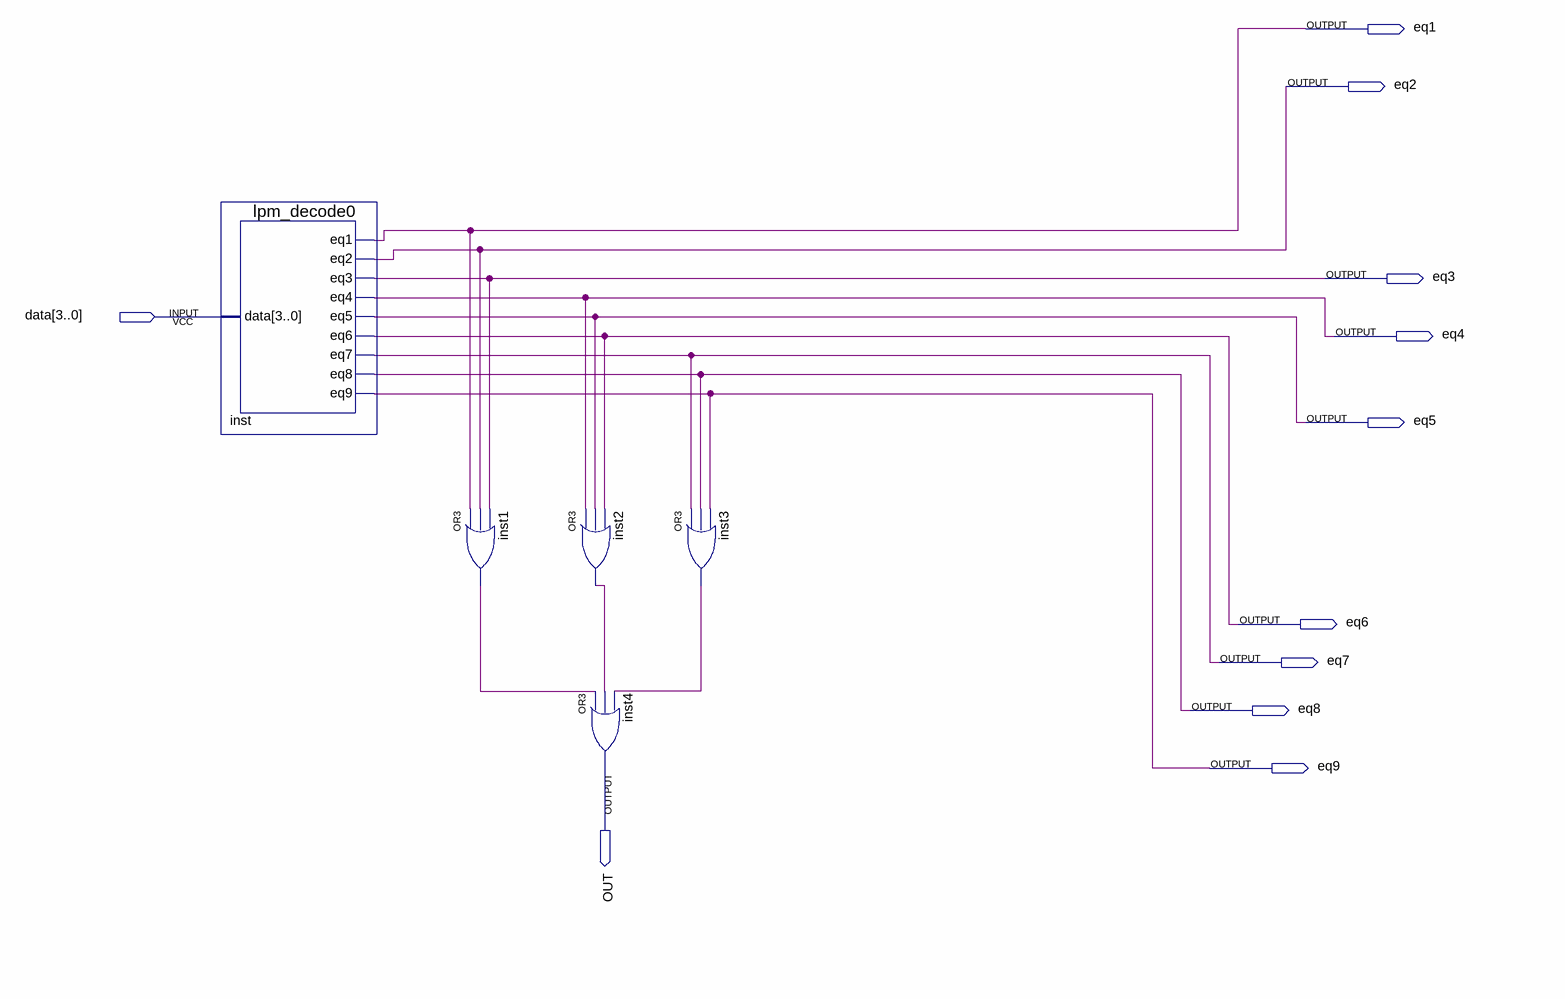
[diagram p0: schematic sheet]
// Quartus schematic Decodificador_jugadas.bdf as structural Verilog: 5 symbols, 11 pins
module Decodificador_jugadas (
  input  [3:0] data,
  output eq1,
  output eq2,
  output eq3,
  output eq4,
  output eq5,
  output eq6,
  output eq7,
  output eq8,
  output OUT,
  output eq9
);

  wire inst1_out, inst2_out, inst3_out;

  lpm_decode0 inst (
    .data(data), .eq1(eq1), .eq2(eq2), .eq3(eq3), .eq4(eq4), .eq5(eq5), .eq6(eq6), .eq7(eq7), .eq8(eq8),
    .eq9(eq9));
  or inst1 (inst1_out, eq1, eq2, eq3);
  or inst2 (inst2_out, eq4, eq5, eq6);
  or inst4 (OUT, inst1_out, inst2_out, inst3_out);
  or inst3 (inst3_out, eq7, eq8, eq9);
endmodule
